# Altium schematic sheet sch5_1.SchDoc
size 840 x 594 mm; Address1: Address1; Address2: Address2; Address3: Address3; Address4: Address4; DocumentNumber: АБВГ.123456.001 Э3; SheetNumber: 1; Scale: 1:1; DocumentType: Схема электрическая принципиальная; FirstReferrence: АБВГ.123456.001
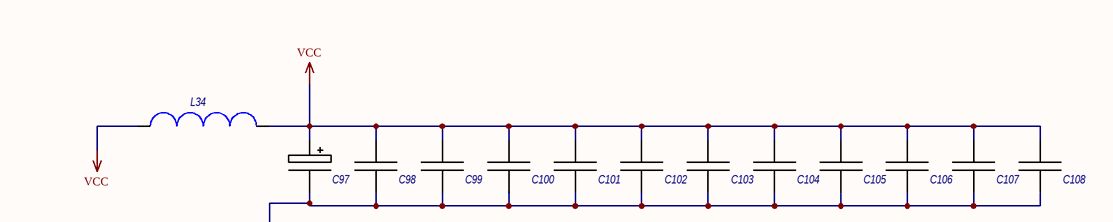
[diagram p0: sch5_1.SchDoc, top left]
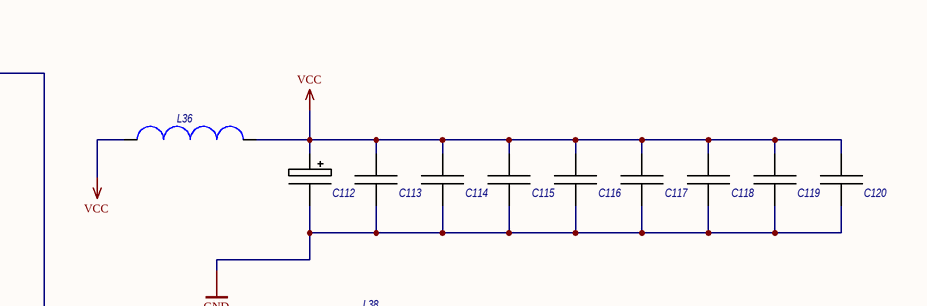
[diagram p1: sch5_1.SchDoc, top right]
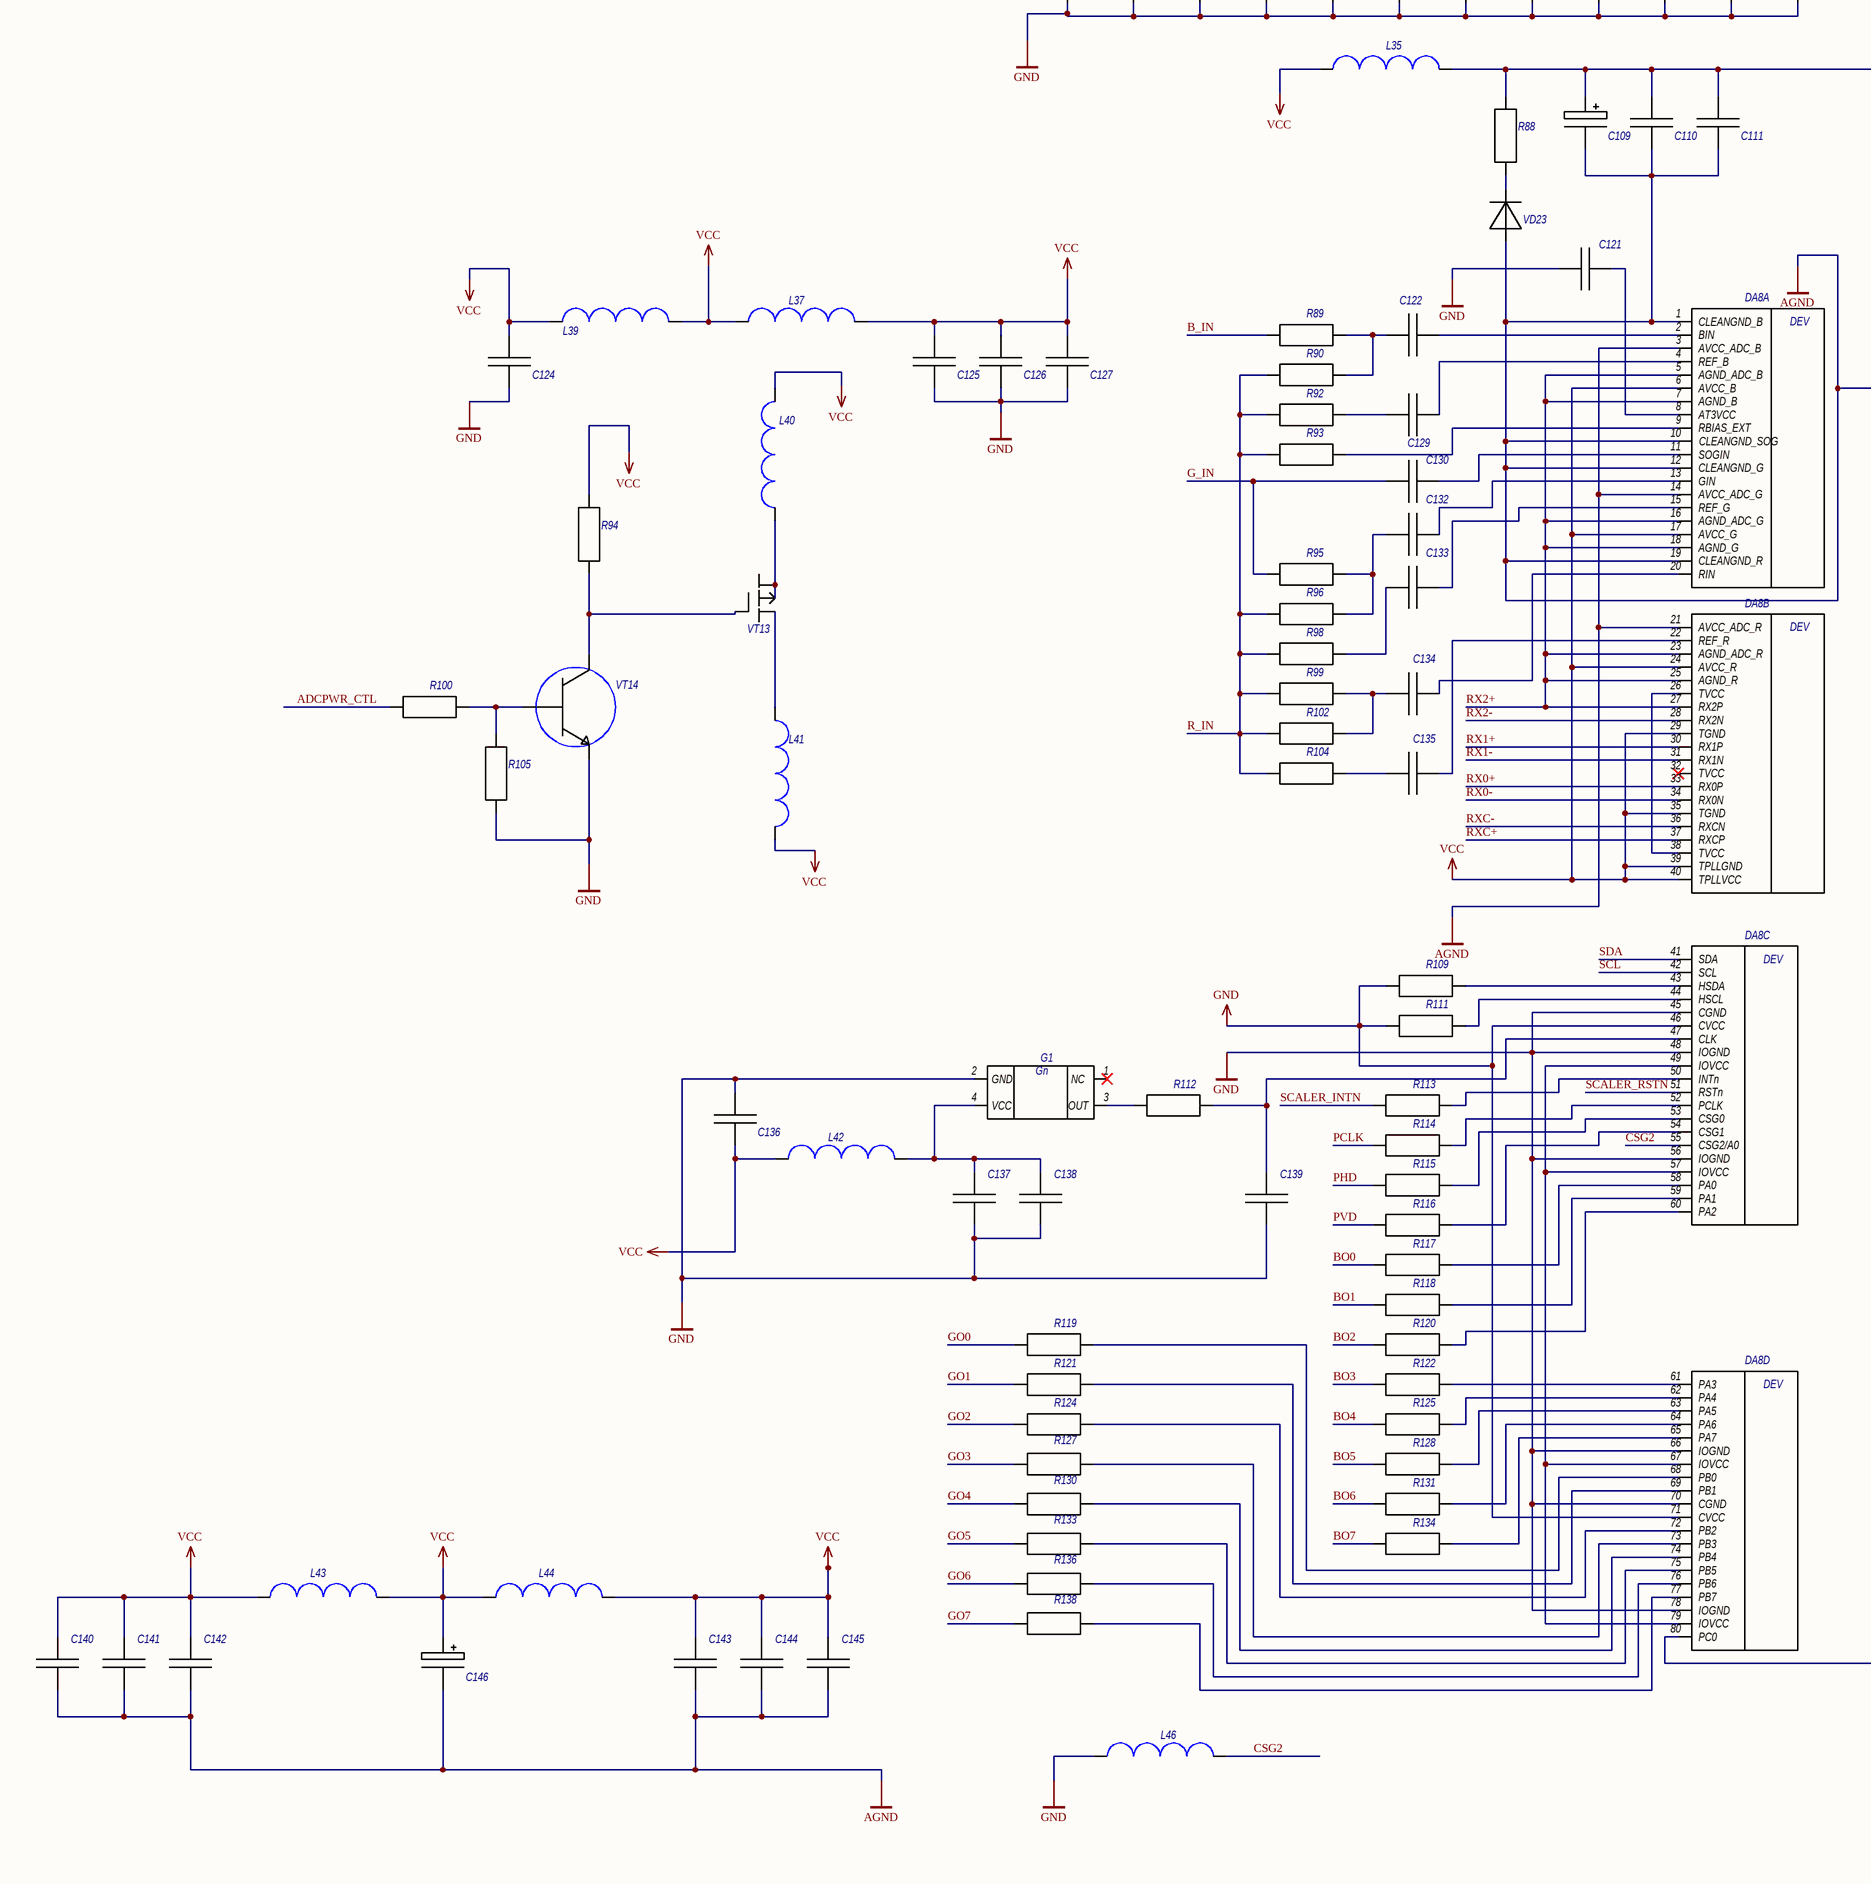
[diagram p2: sch5_1.SchDoc, bottom left]
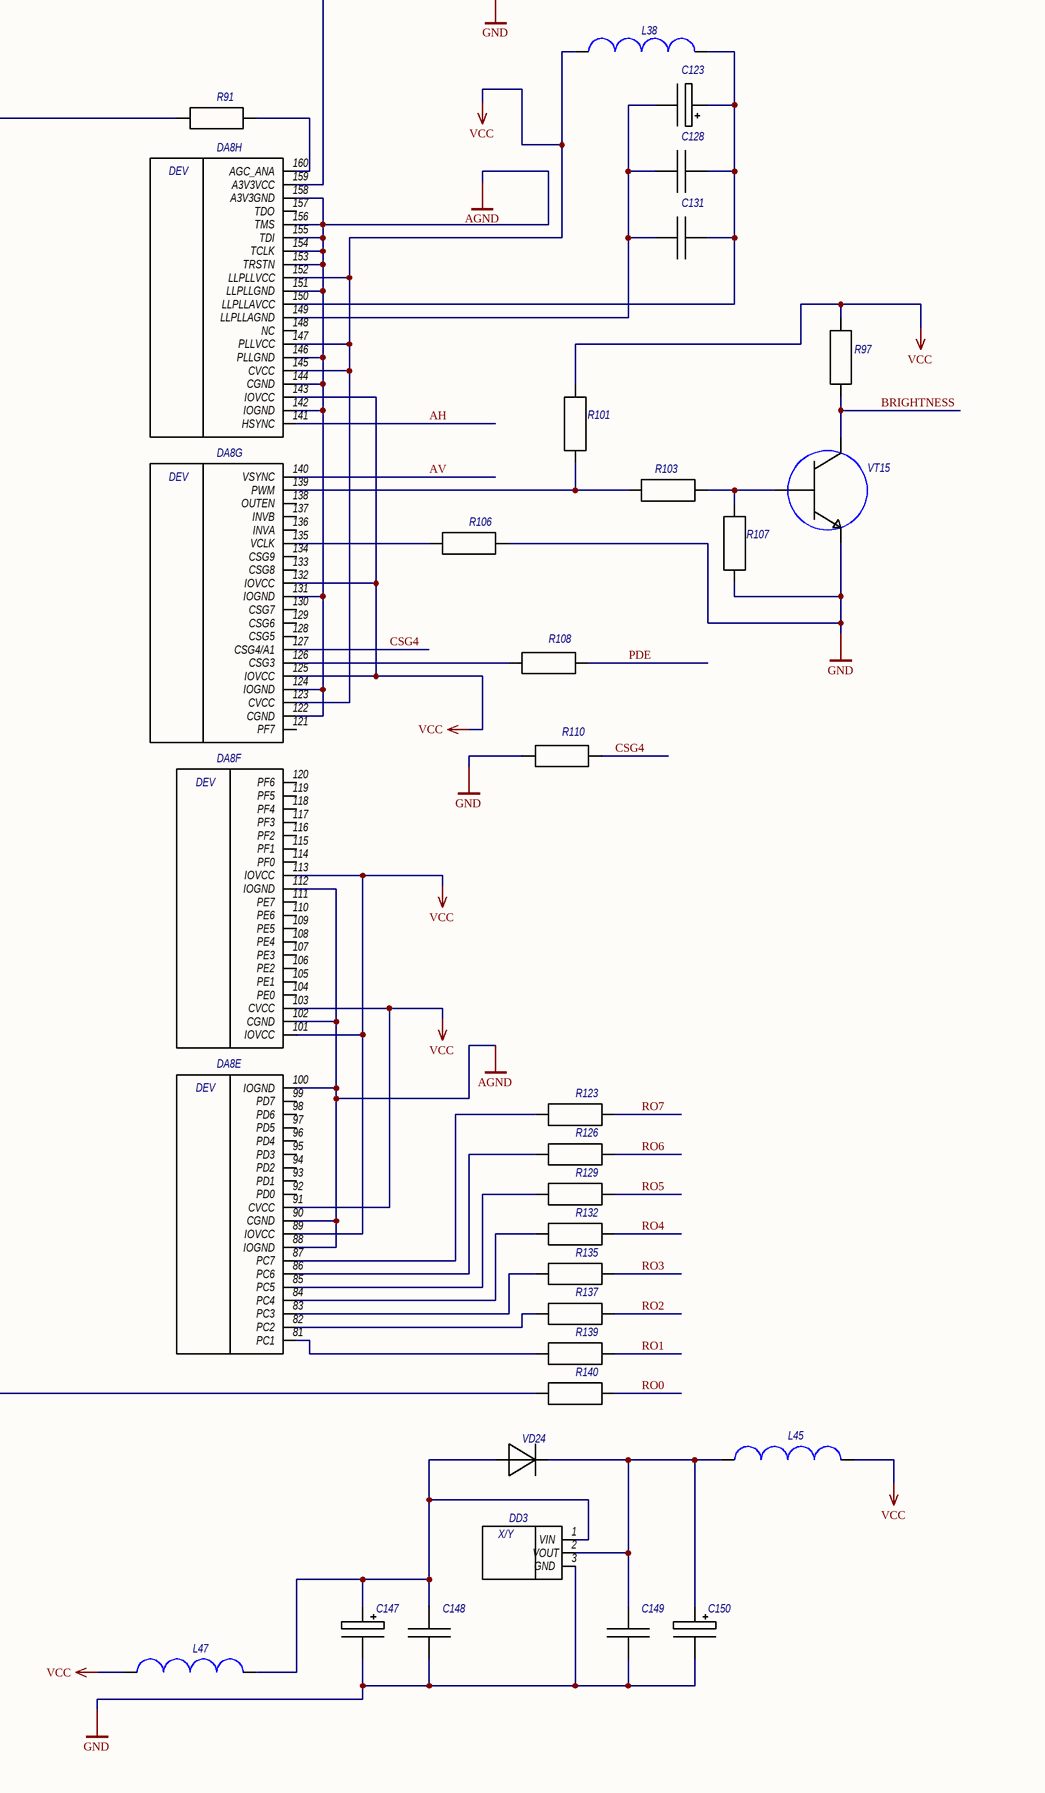
[diagram p3: sch5_1.SchDoc, bottom right]

## Parts
C97  *  [Capacitor 0805]  (value not drawn)
C98  *  [Capacitor 0805]  (value not drawn)
C99  *  [Capacitor 0805]  (value not drawn)
C100  *  [Capacitor 0805]  (value not drawn)
C101  *  [Capacitor 0805]  (value not drawn)
C102  *  [Capacitor 0805]  (value not drawn)
C103  *  [Capacitor 0805]  (value not drawn)
C104  *  [Capacitor 0805]  (value not drawn)
C105  *  [Capacitor 0805]  (value not drawn)
C106  *  [Capacitor 0805]  (value not drawn)
C107  *  [Capacitor 0805]  (value not drawn)
C108  *  [Capacitor 0805]  (value not drawn)
C109  *  [Capacitor 0805]  (value not drawn)
C110  *  [Capacitor 0805]  (value not drawn)
C111  *  [Capacitor 0805]  (value not drawn)
C112  *  [Capacitor 0805]  (value not drawn)
C113  *  [Capacitor 0805]  (value not drawn)
C114  *  [Capacitor 0805]  (value not drawn)
C115  *  [Capacitor 0805]  (value not drawn)
C116  *  [Capacitor 0805]  (value not drawn)
C117  *  [Capacitor 0805]  (value not drawn)
C118  *  [Capacitor 0805]  (value not drawn)
C119  *  [Capacitor 0805]  (value not drawn)
C120  *  [Capacitor 0805]  (value not drawn)
C121  *  [Capacitor 0805]  (value not drawn)
C122  *  [Capacitor 0805]  (value not drawn)
C123  *  [Capacitor 0805]  (value not drawn)
C124  *  [Capacitor 0805]  (value not drawn)
C125  *  [Capacitor 0805]  (value not drawn)
C126  *  [Capacitor 0805]  (value not drawn)
C127  *  [Capacitor 0805]  (value not drawn)
C128  *  [Capacitor 0805]  (value not drawn)
C129  *  [Capacitor 0805]  (value not drawn)
C130  *  [Capacitor 0805]  (value not drawn)
C131  *  [Capacitor 0805]  (value not drawn)
C132  *  [Capacitor 0805]  (value not drawn)
C133  *  [Capacitor 0805]  (value not drawn)
C134  *  [Capacitor 0805]  (value not drawn)
C135  *  [Capacitor 0805]  (value not drawn)
C136  *  [Capacitor 0805]  (value not drawn)
C137  *  [Capacitor 0805]  (value not drawn)
C138  *  [Capacitor 0805]  (value not drawn)
C139  *  [Capacitor 0805]  (value not drawn)
C140  *  [Capacitor 0805]  (value not drawn)
C141  *  [Capacitor 0805]  (value not drawn)
C142  *  [Capacitor 0805]  (value not drawn)
C143  *  [Capacitor 0805]  (value not drawn)
C144  *  [Capacitor 0805]  (value not drawn)
C145  *  [Capacitor 0805]  (value not drawn)
C146  *  [Capacitor 0805]  (value not drawn)
C147  *  [Capacitor 0805]  (value not drawn)
C148  *  [Capacitor 0805]  (value not drawn)
C149  *  [Capacitor 0805]  (value not drawn)
C150  *  [Capacitor 0805]  (value not drawn)
DA8  *  [OMG_1]  (value not drawn)  (parts A,B,C,D,E,F,G,H of 8)
DD3  *  [MIC39]  (value not drawn)
G1  *  [GENERATOR-25MHZ]  (value not drawn)
L34  *  [Inductor 2520]  (value not drawn)
L35  *  [Inductor 2520]  (value not drawn)
L36  *  [Inductor 2520]  (value not drawn)
L37  *  [Inductor 2520]  (value not drawn)
L38  *  [Inductor 2520]  (value not drawn)
L39  *  [Inductor 2520]  (value not drawn)
L40  *  [Inductor 2520]  (value not drawn)
L41  *  [Inductor 2520]  (value not drawn)
L42  *  [Inductor 2520]  (value not drawn)
L43  *  [Inductor 2520]  (value not drawn)
L44  *  [Inductor 2520]  (value not drawn)
L45  *  [Inductor 2520]  (value not drawn)
L46  *  [Inductor 2520]  (value not drawn)
L47  *  [Inductor 2520]  (value not drawn)
R88  *  [Resistor 1206]  (value not drawn)
R89  *  [Resistor 1206]  (value not drawn)
R90  *  [Resistor 1206]  (value not drawn)
R91  *  [Resistor 1206]  (value not drawn)
R92  *  [Resistor 1206]  (value not drawn)
R93  *  [Resistor 1206]  (value not drawn)
R94  *  [Resistor 1206]  (value not drawn)
R95  *  [Resistor 1206]  (value not drawn)
R96  *  [Resistor 1206]  (value not drawn)
R97  *  [Resistor 1206]  (value not drawn)
R98  *  [Resistor 1206]  (value not drawn)
R99  *  [Resistor 1206]  (value not drawn)
R100  *  [Resistor 1206]  (value not drawn)
R101  *  [Resistor 1206]  (value not drawn)
R102  *  [Resistor 1206]  (value not drawn)
R103  *  [Resistor 1206]  (value not drawn)
R104  *  [Resistor 1206]  (value not drawn)
R105  *  [Resistor 1206]  (value not drawn)
R106  *  [Resistor 1206]  (value not drawn)
R107  *  [Resistor 1206]  (value not drawn)
R108  *  [Resistor 1206]  (value not drawn)
R109  *  [Resistor 1206]  (value not drawn)
R110  *  [Resistor 1206]  (value not drawn)
R111  *  [Resistor 1206]  (value not drawn)
R112  *  [Resistor 1206]  (value not drawn)
R113  *  [Resistor 1206]  (value not drawn)
R114  *  [Resistor 1206]  (value not drawn)
R115  *  [Resistor 1206]  (value not drawn)
R116  *  [Resistor 1206]  (value not drawn)
R117  *  [Resistor 1206]  (value not drawn)
R118  *  [Resistor 1206]  (value not drawn)
R119  *  [Resistor 1206]  (value not drawn)
R120  *  [Resistor 1206]  (value not drawn)
R121  *  [Resistor 1206]  (value not drawn)
R122  *  [Resistor 1206]  (value not drawn)
R123  *  [Resistor 1206]  (value not drawn)
R124  *  [Resistor 1206]  (value not drawn)
R125  *  [Resistor 1206]  (value not drawn)
R126  *  [Resistor 1206]  (value not drawn)
R127  *  [Resistor 1206]  (value not drawn)
R128  *  [Resistor 1206]  (value not drawn)
R129  *  [Resistor 1206]  (value not drawn)
R130  *  [Resistor 1206]  (value not drawn)
R131  *  [Resistor 1206]  (value not drawn)
R132  *  [Resistor 1206]  (value not drawn)
R133  *  [Resistor 1206]  (value not drawn)
R134  *  [Resistor 1206]  (value not drawn)
R135  *  [Resistor 1206]  (value not drawn)
R136  *  [Resistor 1206]  (value not drawn)
R137  *  [Resistor 1206]  (value not drawn)
R138  *  [Resistor 1206]  (value not drawn)
R139  *  [Resistor 1206]  (value not drawn)
R140  *  [Resistor 1206]  (value not drawn)
VD23  *  [Diode]  (value not drawn)
VD24  *  [Diode]  (value not drawn)
VT13  MOP TRANSISTOR  [TR]  (value not drawn)
VT14  *  [Transistor 1]  (value not drawn)
VT15  *  [Transistor 1]  (value not drawn)

## Nets
AGND: C109.1 C110.1 C111.1 C140.1 C141.1 C142.1 C143.1 C144.1 C145.1 C146.1 DA8.1(CLEANGND_B) DA8.3(AVCC_ADC_B) DA8.10(CLEANGND_SOG) DA8.12(CLEANGND_G) DA8.14(AVCC_ADC_G) DA8.19(CLEANGND_R) DA8.21(AVCC_ADC_R) DA8.88(IOGND) DA8.90(CGND) DA8.100(IOGND) DA8.102(CGND) DA8.112(IOGND) DA8.122(CGND) DA8.124(IOGND) DA8.131(IOGND) DA8.142(IOGND) DA8.144(CGND) DA8.146(PLLGND) DA8.151(LLPLLGND) DA8.153(TRSTN) DA8.154(TCLK) DA8.155(TDI) DA8.156(TMS) DA8.158(A3V3GND) R91.1 VD23.1
GND: C97.1 C98.1 C99.1 C100.1 C101.1 C102.1 C103.1 C104.1 C105.1 C106.1 C107.1 C108.1 C112.1 C113.1 C114.1 C115.1 C116.1 C117.1 C118.1 C119.1 C120.1 C121.2 C124.1 C125.1 C126.1 C127.1 C136.2 C137.1 C138.1 C139.1 C147.1 C148.1 C149.1 C150.1 DA8.45(CGND) DA8.46(CVCC) DA8.48(IOGND) DA8.56(IOGND) DA8.66(IOGND) DA8.70(CGND) DA8.71(CVCC) DA8.78(IOGND) DD3.3(GND) G1.2(GND) L46.1 R105.1 R106.2 R107.1 R109.1 R110.1 R111.1 VT14.1(KOLLECTOR) VT15.1(KOLLECTOR)
VCC: C97.2 C98.2 C99.2 C100.2 C101.2 C102.2 C103.2 C104.2 C105.2 C106.2 C107.2 C108.2 C112.2 C113.2 C114.2 C115.2 C116.2 C117.2 C118.2 C119.2 C120.2 C124.2 C125.2 C126.2 C127.2 C136.1 C140.2 C141.2 C142.2 C143.2 C144.2 C145.2 C146.2 DA8.6(AVCC_B) DA8.17(AVCC_G) DA8.24(AVCC_R) DA8.29(TGND) DA8.35(TGND) DA8.39(TPLLGND) DA8.40(TPLLVCC) DA8.89(IOVCC) DA8.91(CVCC) DA8.101(IOVCC) DA8.103(CVCC) DA8.113(IOVCC) DA8.123(CVCC) DA8.125(IOVCC) DA8.132(IOVCC) DA8.143(IOVCC) DA8.145(CVCC) DA8.147(PLLVCC) DA8.152(LLPLLVCC) L34.1 L34.2 L35.1 L36.1 L36.2 L37.1 L37.2 L38.1 L39.1 L39.2 L40.2 L41.2 L42.1 L43.1 L43.2 L44.1 L44.2 L45.2 L47.1 R94.2 R97.2 R101.2
ADCPWR_CTL: R100.1
AH: DA8.141(HSYNC)
AV: DA8.140(VSYNC)
B_IN: R89.1
BO0: R117.1
BO1: R118.1
BO2: R120.1
BO3: R122.1
BO4: R125.1
BO5: R128.1
BO6: R131.1
BO7: R134.1
BRIGHTNESS: R97.1 VT15.2(EMITTER)
CSG2: DA8.55(CSG2/A0) L46.2
CSG4: DA8.127(CSG4/A1) R110.2
G_IN: C130.2 R95.1
GO0: R119.1
GO1: R121.1
GO2: R124.1
GO3: R127.1
GO4: R130.1
GO5: R133.1
GO6: R136.1
GO7: R138.1
PCLK: R114.1
PDE: R108.2
PHD: R115.1
PVD: R116.1
R_IN: R90.1 R92.1 R93.1 R96.1 R98.1 R99.1 R102.1 R104.1
RO0: R140.2
RO1: R139.2
RO2: R137.2
RO3: R135.2
RO4: R132.2
RO5: R129.2
RO6: R126.2
RO7: R123.2
RX0+: DA8.33(RX0P)
RX0-: DA8.34(RX0N)
RX1+: DA8.30(RX1P)
RX1-: DA8.31(RX1N)
RX2+: DA8.5(AGND_ADC_B) DA8.7(AGND_B) DA8.16(AGND_ADC_G) DA8.18(AGND_G) DA8.23(AGND_ADC_R) DA8.25(AGND_R) DA8.27(RX2P)
RX2-: DA8.28(RX2N)
RXC+: DA8.37(RXCP)
RXC-: DA8.36(RXCN)
SCALER_INTN: R113.1
SCALER_RSTN: DA8.51(RSTn)
SCL: DA8.42(SCL)
SDA: DA8.41(SDA)
NetC109_2: C109.2 C110.2 C111.2 DA8.159(A3V3VCC) L35.2 R88.2
NetC121_1: C121.1 DA8.8(AT3VCC)
NetC122_1: C122.1 DA8.2(BIN)
NetC122_2: C122.2 R89.2 R90.2
NetC123_1: C123.1 C128.2 C131.2 DA8.149(LLPLLAGND)
NetC123_2: C123.2 C128.1 C131.1 DA8.150(LLPLLAVCC) L38.2
NetC129_1: C129.1 DA8.4(REF_B)
NetC129_2: C129.2 R92.2
NetC130_1: C130.1 DA8.11(SOGIN)
NetC132_1: C132.1 DA8.13(GIN)
NetC132_2: C132.2 R95.2 R96.2
NetC133_1: C133.1 DA8.15(REF_G)
NetC133_2: C133.2 R98.2
NetC134_1: C134.1 DA8.20(RIN)
NetC134_2: C134.2 R99.2 R102.2
NetC135_1: C135.1 DA8.22(REF_R)
NetC135_2: C135.2 R104.2
NetC137_2: C137.2 C138.2 G1.4(VCC) L42.2
NetC139_2: C139.2 DA8.47(CLK) R112.2
NetC147_2: C147.2 C148.2 DD3.1(VIN) L47.2 VD24.1
NetC149_2: C149.2 C150.2 DD3.2(VOUT) L45.1 VD24.2
NetDA8_9: DA8.9(RBIAS_EXT) R93.2
NetDA8_26: DA8.26(TVCC) DA8.38(TVCC)
NetDA8_43: DA8.43(HSDA) R109.2
NetDA8_44: DA8.44(HSCL) R111.2
NetDA8_49: DA8.49(IOVCC) DA8.57(IOVCC) DA8.67(IOVCC) DA8.79(IOVCC)
NetDA8_50: DA8.50(INTn) R113.2
NetDA8_52: DA8.52(PCLK) R114.2
NetDA8_53: DA8.53(CSG0) R115.2
NetDA8_54: DA8.54(CSG1) R116.2
NetDA8_58: DA8.58(PA0) R117.2
NetDA8_59: DA8.59(PA1) R118.2
NetDA8_60: DA8.60(PA2) R120.2
NetDA8_61: DA8.61(PA3) R122.2
NetDA8_62: DA8.62(PA4) R125.2
NetDA8_63: DA8.63(PA5) R128.2
NetDA8_64: DA8.64(PA6) R131.2
NetDA8_65: DA8.65(PA7) R134.2
NetDA8_68: DA8.68(PB0) R119.2
NetDA8_69: DA8.69(PB1) R121.2
NetDA8_72: DA8.72(PB2) R124.2
NetDA8_73: DA8.73(PB3) R127.2
NetDA8_74: DA8.74(PB4) R130.2
NetDA8_75: DA8.75(PB5) R133.2
NetDA8_76: DA8.76(PB6) R136.2
NetDA8_77: DA8.77(PB7) R138.2
NetDA8_80: DA8.80(PC0) R140.1
NetDA8_81: DA8.81(PC1) R139.1
NetDA8_82: DA8.82(PC2) R137.1
NetDA8_83: DA8.83(PC3) R135.1
NetDA8_84: DA8.84(PC4) R132.1
NetDA8_85: DA8.85(PC5) R129.1
NetDA8_86: DA8.86(PC6) R126.1
NetDA8_87: DA8.87(PC7) R123.1
NetDA8_126: DA8.126(CSG3) R108.1
NetDA8_135: DA8.135(VCLK) R106.1
NetDA8_139: DA8.139(PWM) R101.1 R103.1
NetDA8_160: DA8.160(AGC_ANA) R91.2
NetG1_3: G1.3(OUT) R112.1
NetL40_1: L40.1 VT13.3 VT13.4
NetL41_1: L41.1 VT13.2
NetR88_1: R88.1 VD23.2
NetR94_1: R94.1 VT13.1 VT14.2(EMITTER)
NetR100_2: R100.2 R105.2 VT14.3(BAZA)
NetR103_2: R103.2 R107.2 VT15.3(BAZA)

Not connected (* = marked no-connect by the designer): DA8 32(TVCC)* 92(PD0) 93(PD1) 94(PD2) 95(PD3) 96(PD4) 97(PD5) 98(PD6) 99(PD7) 104(PE0) 105(PE1) 106(PE2) 107(PE3) 108(PE4) 109(PE5) 110(PE6) 111(PE7) 114(PF0) 115(PF1) 116(PF2) 117(PF3) 118(PF4) 119(PF5) 120(PF6) 121(PF7) 128(CSG5) 129(CSG6) 130(CSG7) 133(CSG8) 134(CSG9) 136(INVA) 137(INVB) 138(OUTEN) 148(NC) 157(TDO); G1 1(NC)*

## Notes on the sheet
- Перв. примен.
- Справ. №
- Подп. и дата
- Инв. № дубл.
- Взам. инв. №
- Разраб.
- Изм.
- Лист
- № докум.
- Подп.
- Дата
- Лит.
- Масса
- Масштаб
- Пров.
- Т.контр.
- Листов
- Инв. № подл.
- Утв.
- Н.контр.
- 2.106-A1
- Копировал
- Формат А1
- (in symbol MHZ25) Gn
- (in symbol MIC39) X/Y
- (in symbol OMG, part A) DEV
- (in symbol OMG, part B) DEV
- (in symbol OMG, part C) DEV
- (in symbol OMG, part D) DEV
- (in symbol OMG, part E) DEV
- (in symbol OMG, part F) DEV
- (in symbol OMG, part G) DEV
- (in symbol OMG, part H) DEV

## Library data of the parts
C97 C109 C112 C123 C146 C147 C150 = Capacitor Duga: Model: *
C98-C108 C110 C111 C113-C122 C124-C145 C148 C149 = Capacitor: Model: *
DA8 = OMG
DD3 = MIC39
G1 = MHZ25
L34-L47 = Inductor: Model: *
R88-R140 = Resistor: Model: *
VD23 VD24 = Diode 1: Model: *
VT14 VT15 = Transistor 1